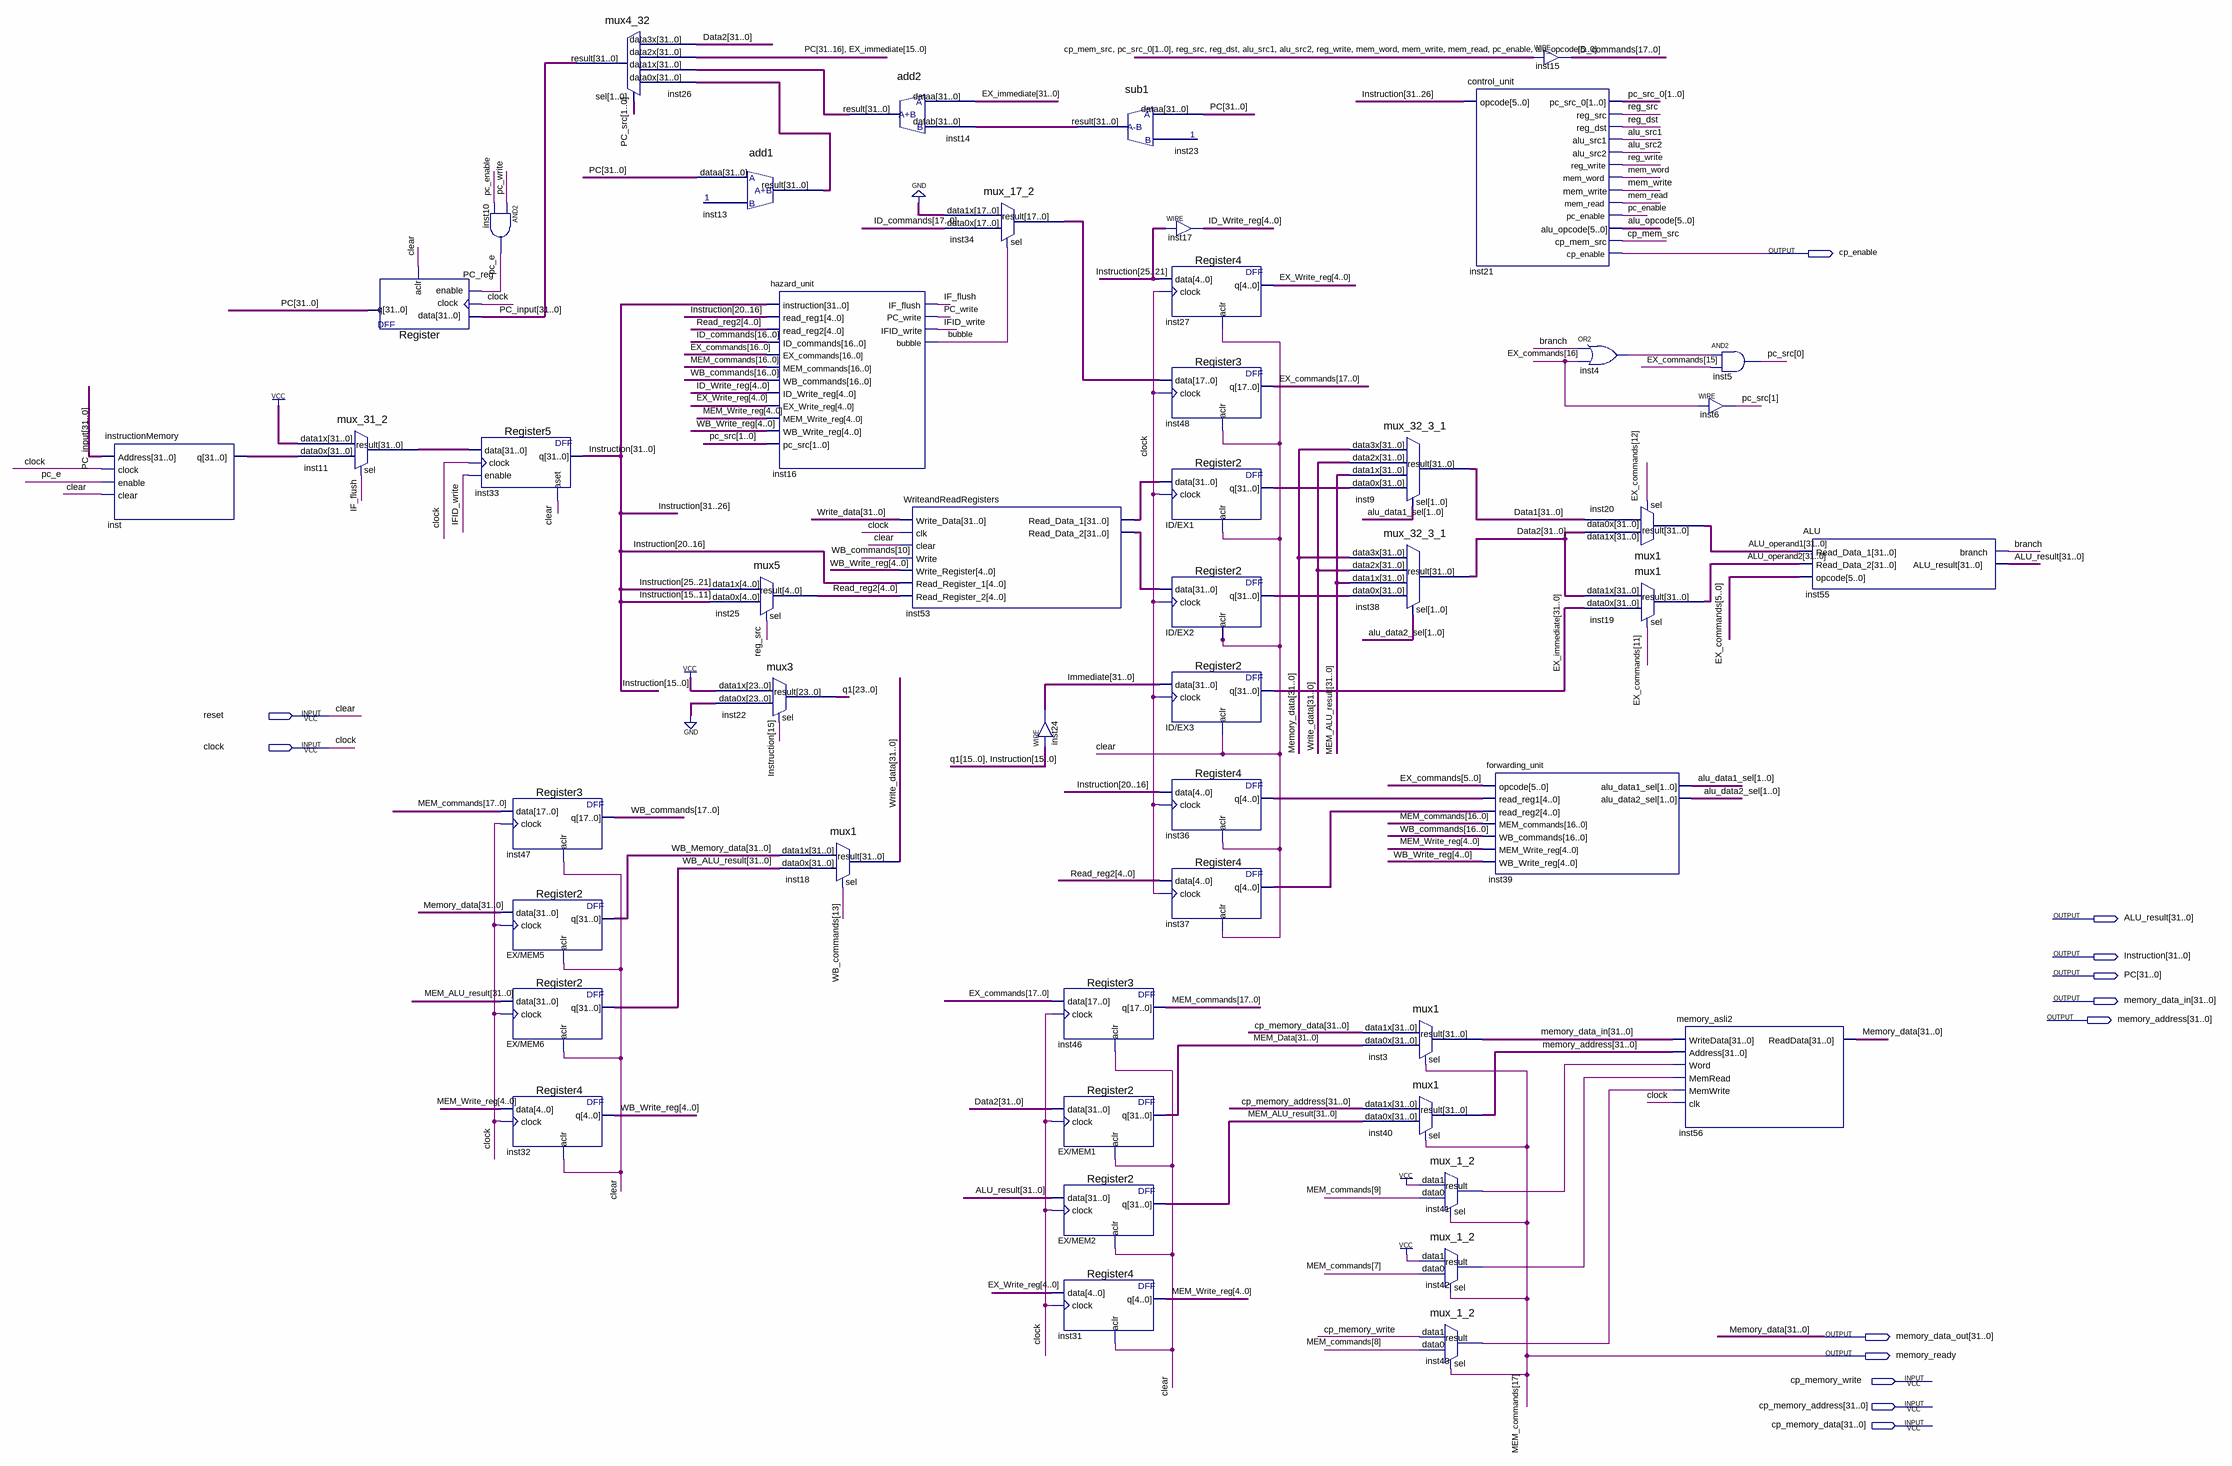
[diagram p0: schematic sheet]
// Quartus schematic Datapath.bdf as structural Verilog: 49 symbols, 13 pins
module Datapath (
  input  reset,
  input  clock,
  input  cp_memory_write,
  input  [31:0] cp_memory_address,
  input  [31:0] cp_memory_data,
  output cp_enable,
  output [31:0] ALU_result,
  output [31:0] Instruction,
  output [31:0] PC,
  output [31:0] memory_data_in,
  output [31:0] memory_address,
  output [31:0] memory_data_out,
  output memory_ready
);

  wire alu_src1, alu_src2, branch, bubble, cp_mem_src, IF_flush, IFID_write, inst4_out, inst41_result,
       inst42_result, inst43_result, mem_read, mem_word, mem_write, pc_e, pc_enable, pc_write, reg_dst,
       reg_src, reg_write;
  wire [1:0] alu_data1_sel, alu_data2_sel, PC_src, pc_src_0;
  wire [4:0] EX_Write_reg, ID_Write_reg, inst36_q, inst37_q, MEM_Write_reg, Read_reg2, WB_Write_reg;
  wire [5:0] alu_opcode;
  wire [16:0] MEM_commands;
  wire [17:0] EX_commands, ID_commands, inst34_result, WB_commands;
  wire [23:0] q1;
  wire [31:0] ALU_operand1, ALU_operand2, Data1, Data2, EX_immediate, ID_EX1_q, ID_EX2_q, Immediate,
       inst11_result, inst13_result, inst14_result, inst23_result, inst53_read_data_1, inst53_read_data_2,
       inst_q, MEM_ALU_result, MEM_Data, PC_input, WB_ALU_result, WB_Memory_data, Write_data;

  instructionMemory inst (.Address(PC_input), .clock(clock), .enable(pc_e), .clear(reset), .q(inst_q));
  mux_31_2 inst11 (.data1x({32{1'b1}}), .data0x(inst_q), .sel(IF_flush), .result(inst11_result));
  Register PC_reg (.data(PC_input), .clock(clock), .enable(pc_e), .aclr(reset), .q(PC));
  and inst10 (pc_e, pc_write, pc_enable);
  Register5 inst33 (.data(inst11_result), .clock(clock), .enable(IFID_write), .aset(reset), .q(Instruction));
  Register3 inst47 (.data({memory_ready, MEM_commands}), .clock(clock), .aclr(reset), .q(WB_commands));
  Register2 \EX/MEM5  (.data(memory_data_out), .clock(clock), .aclr(reset), .q(WB_Memory_data));
  Register2 \EX/MEM6  (.data(MEM_ALU_result), .clock(clock), .aclr(reset), .q(WB_ALU_result));
  Register4 inst32 (.data(MEM_Write_reg), .clock(clock), .aclr(reset), .q(WB_Write_reg));
  mux4_32 inst26 (
    .data3x(Data2), .data2x({PC[31:16], EX_immediate[15:0]}), .data1x(inst14_result), .data0x(inst13_result),
    .sel(PC_src), .result(PC_input));
  add1 inst13 (.dataa(PC), .result(inst13_result));
  mux5 inst25 (.data1x(Instruction[25:21]), .data0x(Instruction[15:11]), .sel(reg_src), .result(Read_reg2));
  mux3 inst22 (.data1x({24{1'b1}}), .data0x({24{1'b0}}), .sel(Instruction[15]), .result(q1));
  hazard_unit inst16 (
    .instruction(Instruction), .read_reg1(Instruction[20:16]), .read_reg2(Read_reg2),
    .ID_commands(ID_commands[16:0]), .EX_commands(EX_commands[16:0]), .MEM_commands(MEM_commands),
    .WB_commands(WB_commands[16:0]), .ID_Write_reg(ID_Write_reg), .EX_Write_reg(EX_Write_reg),
    .MEM_Write_reg(MEM_Write_reg), .WB_Write_reg(WB_Write_reg), .pc_src(PC_src), .IF_flush(IF_flush),
    .PC_write(pc_write), .IFID_write(IFID_write), .bubble(bubble));
  mux1 inst18 (.data1x(WB_Memory_data), .data0x(WB_ALU_result), .sel(WB_commands[13]), .result(Write_data));
  add2 inst14 (.dataa(EX_immediate), .datab(inst23_result), .result(inst14_result));
  WriteandReadRegisters inst53 (
    .Write_Data(Write_data), .clk(clock), .clear(reset), .Write(WB_commands[10]),
    .Write_Register(WB_Write_reg), .Read_Register_1(Instruction[20:16]), .Read_Register_2(Read_reg2),
    .Read_Data_1(inst53_read_data_1), .Read_Data_2(inst53_read_data_2));
  mux_17_2 inst34 (.data1x({18{1'b0}}), .data0x(ID_commands), .sel(bubble), .result(inst34_result));
  assign Immediate = {q1[15:0], Instruction[15:0]};  // WIRE inst24
  sub1 inst23 (.dataa(PC), .result(inst23_result));
  Register3 inst46 (.data(EX_commands), .clock(clock), .aclr(reset), .q({memory_ready, MEM_commands}));
  Register2 \EX/MEM1  (.data(Data2), .clock(clock), .aclr(reset), .q(MEM_Data));
  Register2 \EX/MEM2  (.data(ALU_result), .clock(clock), .aclr(reset), .q(MEM_ALU_result));
  Register4 inst31 (.data(EX_Write_reg), .clock(clock), .aclr(reset), .q(MEM_Write_reg));
  assign ID_Write_reg = Instruction[25:21];  // WIRE inst17
  Register4 inst27 (.data(Instruction[25:21]), .clock(clock), .aclr(reset), .q(EX_Write_reg));
  Register3 inst48 (.data(inst34_result), .clock(clock), .aclr(reset), .q(EX_commands));
  Register2 \ID/EX1  (.data(inst53_read_data_1), .clock(clock), .aclr(reset), .q(ID_EX1_q));
  Register2 \ID/EX2  (.data(inst53_read_data_2), .clock(clock), .aclr(reset), .q(ID_EX2_q));
  Register2 \ID/EX3  (.data(Immediate), .clock(clock), .aclr(reset), .q(EX_immediate));
  Register4 inst36 (.data(Instruction[20:16]), .clock(clock), .aclr(reset), .q(inst36_q));
  Register4 inst37 (.data(Read_reg2), .clock(clock), .aclr(reset), .q(inst37_q));
  mux_32_3_1 inst9 (
    .data3x(memory_data_out), .data2x(Write_data), .data1x(MEM_ALU_result), .data0x(ID_EX1_q),
    .sel(alu_data1_sel), .result(Data1));
  mux_32_3_1 inst38 (
    .data3x(memory_data_out), .data2x(Write_data), .data1x(MEM_ALU_result), .data0x(ID_EX2_q),
    .sel(alu_data2_sel), .result(Data2));
  mux1 inst3 (.data1x(cp_memory_data), .data0x(MEM_Data), .sel(memory_ready), .result(memory_data_in));
  mux1 inst40 (.data1x(cp_memory_address), .data0x(MEM_ALU_result), .sel(memory_ready), .result(memory_address));
  mux_1_2 inst41 (.data1(1'b1), .data0(MEM_commands[9]), .sel(memory_ready), .result(inst41_result));
  mux_1_2 inst42 (.data1(1'b1), .data0(MEM_commands[7]), .sel(memory_ready), .result(inst42_result));
  mux_1_2 inst43 (.data1(cp_memory_write), .data0(MEM_commands[8]), .sel(memory_ready), .result(inst43_result));
  control_unit inst21 (
    .opcode(Instruction[31:26]), .pc_src_0(pc_src_0), .reg_src(reg_src), .reg_dst(reg_dst),
    .alu_src1(alu_src1), .alu_src2(alu_src2), .reg_write(reg_write), .mem_word(mem_word),
    .mem_write(mem_write), .mem_read(mem_read), .pc_enable(pc_enable), .alu_opcode(alu_opcode),
    .cp_mem_src(cp_mem_src), .cp_enable(cp_enable));
  forwarding_unit inst39 (
    .opcode(EX_commands[5:0]), .read_reg1(inst36_q), .read_reg2(inst37_q), .MEM_commands(MEM_commands),
    .WB_commands(WB_commands[16:0]), .MEM_Write_reg(MEM_Write_reg), .WB_Write_reg(WB_Write_reg),
    .alu_data1_sel(alu_data1_sel), .alu_data2_sel(alu_data2_sel));
  assign ID_commands = {cp_mem_src, pc_src_0, reg_src, reg_dst, alu_src1, alu_src2, reg_write, mem_word, mem_write, mem_read, pc_enable, alu_opcode};  // WIRE inst15
  or inst4 (inst4_out, branch, EX_commands[16]);
  mux1 inst20 (.data1x(Data2), .data0x(Data1), .sel(EX_commands[12]), .result(ALU_operand1));
  mux1 inst19 (.data1x(Data2), .data0x(EX_immediate), .sel(EX_commands[11]), .result(ALU_operand2));
  assign PC_src[1] = EX_commands[16];  // WIRE inst6
  memory_asli2 inst56 (
    .WriteData(memory_data_in), .Address(memory_address), .Word(inst41_result), .MemRead(inst42_result),
    .MemWrite(inst43_result), .clk(clock), .ReadData(memory_data_out));
  and inst5 (PC_src[0], inst4_out, EX_commands[15]);
  ALU inst55 (
    .Read_Data_1(ALU_operand1), .Read_Data_2(ALU_operand2), .opcode(EX_commands[5:0]), .branch(branch),
    .ALU_result(ALU_result));

  // Other names for the same wires on the sheet: clear = reset; Memory_data[31:0] = memory_data_out;
  //   MEM_commands[17] = memory_ready
endmodule
